# Altium project local.PrjPcb
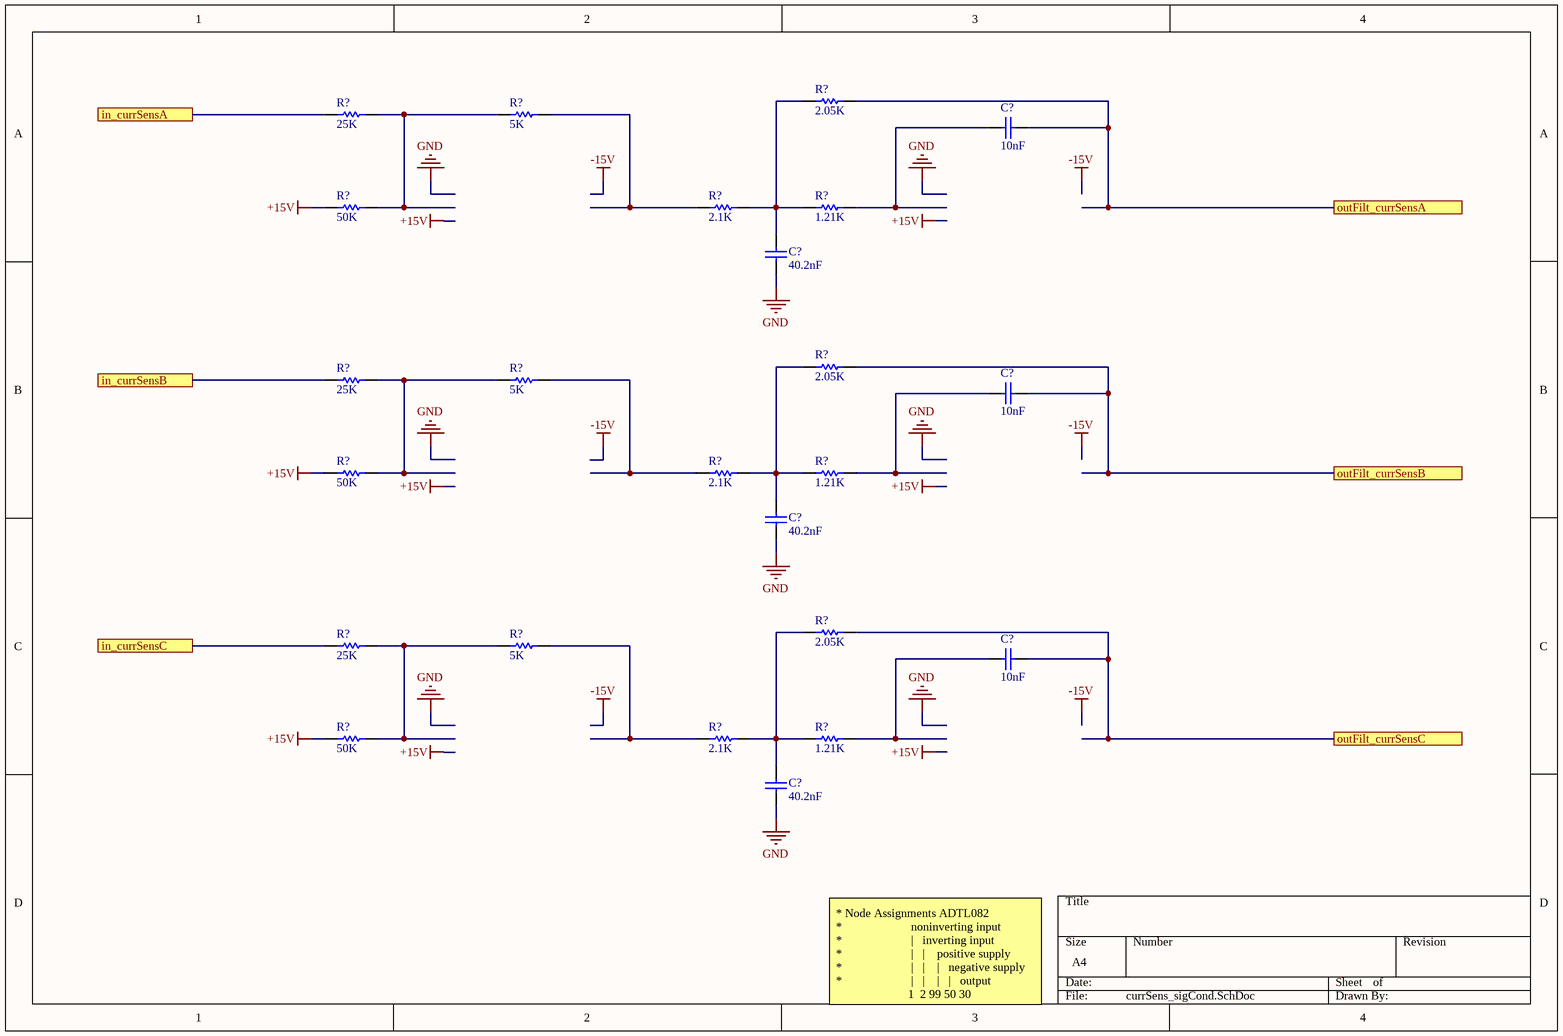
[diagram p0: currSens_sigCond.SchDoc]
4 sheets, 63 parts. Net scope: hierarchical (ports join the sheet entries above them; power ports are global).
Sheets:
  currSens_sigCond.SchDoc
  voltSens_sigCond.SchDoc
  connector.SchDoc
    Designator = buffer.SchDoc

## Sheet currSens_sigCond.SchDoc
size A4; SheetNumber: 1; SheetTotal: 4; SPICEModelCacheTGBYDHUA: <root> / <DocumentId>TGBYDHUA</DocumentId> / </root>

### Parts
(Parts that share a designator on the sheet are numbered #1, #2 ... from top to bottom, then left to right.)
C?#1  value 10nF  (hidden comment: Capacitor)
C?#2  value 40.2nF  (hidden comment: Capacitor)
C?#3  value 10nF  (hidden comment: Capacitor)
C?#4  value 40.2nF  (hidden comment: Capacitor)
C?#5  value 10nF  (hidden comment: Capacitor)
C?#6  value 40.2nF  (hidden comment: Capacitor)
R?#1  value 2.05K  (hidden comment: Resistor)
R?#2  value 25K  (hidden comment: Resistor)
R?#3  value 5K  (hidden comment: Resistor)
R?#4  value 50K  (hidden comment: Resistor)
R?#5  value 2.1K  (hidden comment: Resistor)
R?#6  value 1.21K  (hidden comment: Resistor)
R?#7  value 2.05K  (hidden comment: Resistor)
R?#8  value 25K  (hidden comment: Resistor)
R?#9  value 5K  (hidden comment: Resistor)
R?#10  value 50K  (hidden comment: Resistor)
R?#11  value 2.1K  (hidden comment: Resistor)
R?#12  value 1.21K  (hidden comment: Resistor)
R?#13  value 2.05K  (hidden comment: Resistor)
R?#14  value 25K  (hidden comment: Resistor)
R?#15  value 5K  (hidden comment: Resistor)
R?#16  value 50K  (hidden comment: Resistor)
R?#17  value 2.1K  (hidden comment: Resistor)
R?#18  value 1.21K  (hidden comment: Resistor)

### Ports
in_currSensA, in_currSensB, in_currSensC, outFilt_currSensA, outFilt_currSensB, outFilt_currSensC

### Nets
+15V: R?#4.1 R?#10.1 R?#16.1
GND: C?#2.1 C?#4.1 C?#6.1
NetC?#1_1: C?#1.1 R?#6.2
NetC?#1_2: C?#1.2 R?#1.2 ; port outFilt_currSensA
NetC?#2_2: C?#2.2 R?#1.1 R?#5.2 R?#6.1
NetC?#3_1: C?#3.1 R?#12.2
NetC?#3_2: C?#3.2 R?#7.2 ; port outFilt_currSensB
NetC?#4_2: C?#4.2 R?#7.1 R?#11.2 R?#12.1
NetC?#5_1: C?#5.1 R?#18.2
NetC?#5_2: C?#5.2 R?#13.2 ; port outFilt_currSensC
NetC?#6_2: C?#6.2 R?#13.1 R?#17.2 R?#18.1
NetR?#2_1: R?#2.1 ; port in_currSensA
NetR?#2_2: R?#2.2 R?#3.1 R?#4.2
NetR?#3_2: R?#3.2 R?#5.1
NetR?#8_1: R?#8.1 ; port in_currSensB
NetR?#8_2: R?#8.2 R?#9.1 R?#10.2
NetR?#9_2: R?#9.2 R?#11.1
NetR?#14_1: R?#14.1 ; port in_currSensC
NetR?#14_2: R?#14.2 R?#15.1 R?#16.2
NetR?#15_2: R?#15.2 R?#17.1

### Notes on the sheet
- * Node Assignments ADTL082
  *                       noninverting input
  *                       |   inverting input
  *                       |   |    positive supply
  *                       |   |    |   negative supply
  *                       |   |    |   |   output
  1  2 99 50 30

### Library data of the parts
C?#1-C?#6 = Capacitor: SimulationGenericComponent: True
R?#1-R?#18 = Resistor: TC1: 0; SimulationGenericComponent: True; TC2: 0

## Sheet voltSens_sigCond.SchDoc
size A4; SheetNumber: 2; SheetTotal: 4; SPICEModelCacheTGBYDHUA: <root> / <DocumentId>TGBYDHUA</DocumentId> / </root>
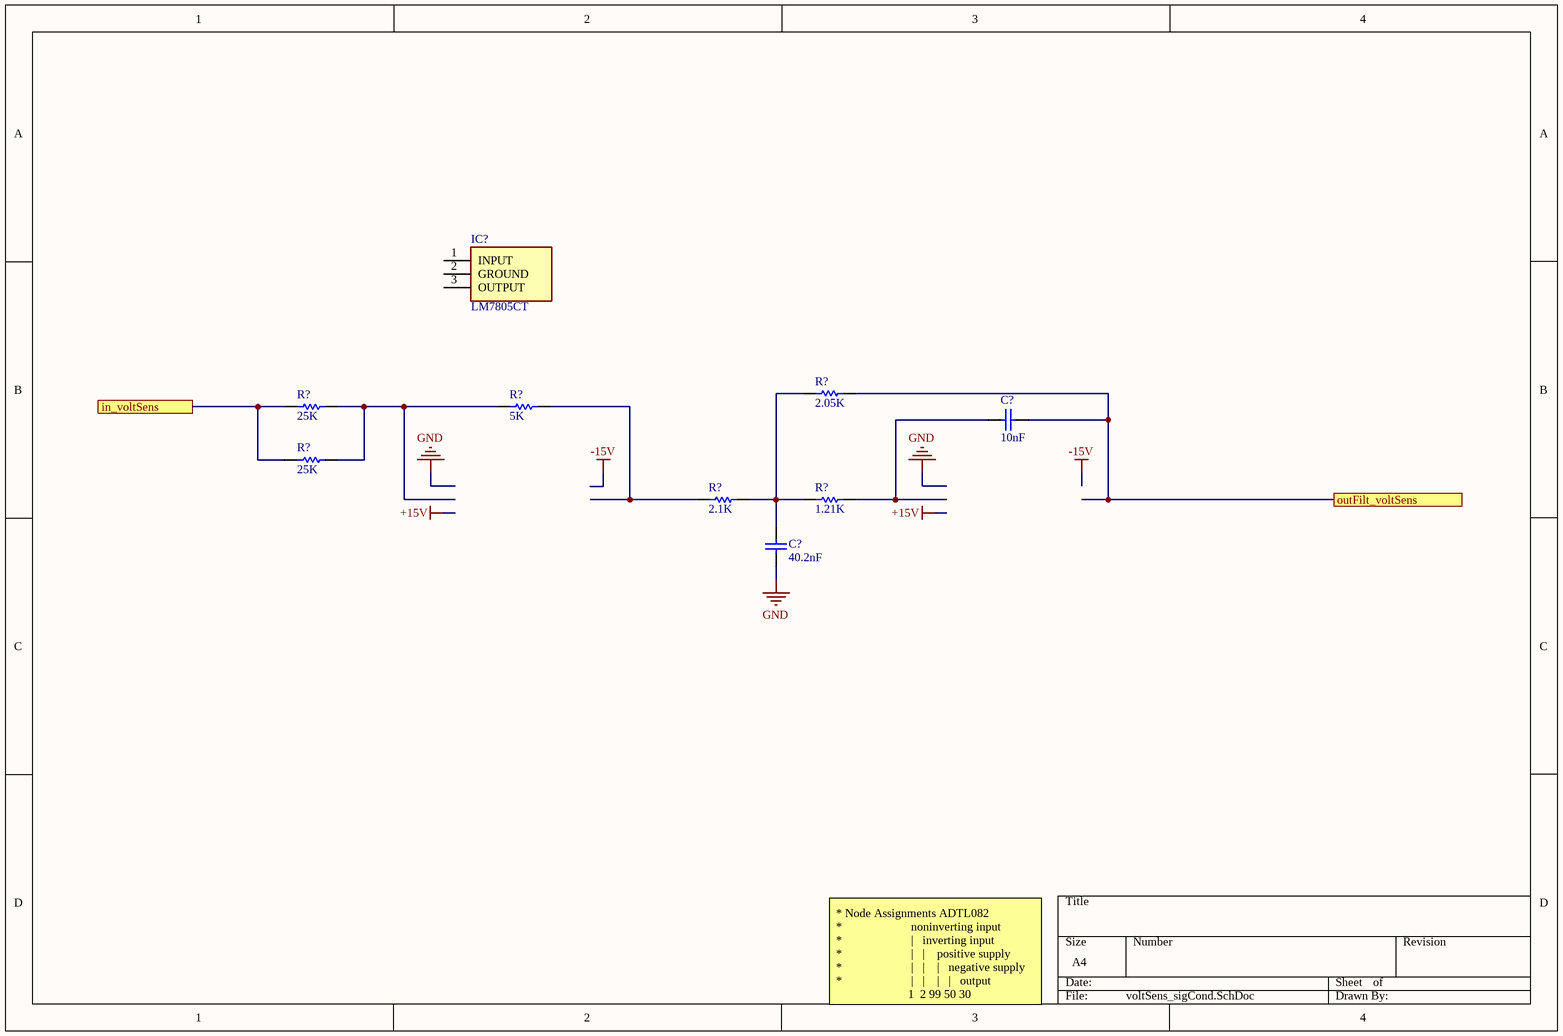
[diagram p1: voltSens_sigCond.SchDoc]

### Parts
(Parts that share a designator on the sheet are numbered #1, #2 ... from top to bottom, then left to right.)
C?#7  value 10nF  (hidden comment: Capacitor)
C?#8  value 40.2nF  (hidden comment: Capacitor)
IC?#1  LM7805CT  [TO254P470X1028X1955-3P]
R?#19  value 2.05K  (hidden comment: Resistor)
R?#20  value 25K  (hidden comment: Resistor)
R?#21  value 5K  (hidden comment: Resistor)
R?#22  value 25K  (hidden comment: Resistor)
R?#23  value 2.1K  (hidden comment: Resistor)
R?#24  value 1.21K  (hidden comment: Resistor)

### Ports
in_voltSens, outFilt_voltSens

### Nets
GND: C?#8.1
NetC?#7_1: C?#7.1 R?#24.2
NetC?#7_2: C?#7.2 R?#19.2 ; port outFilt_voltSens
NetC?#8_2: C?#8.2 R?#19.1 R?#23.2 R?#24.1
NetR?#20_1: R?#20.1 R?#22.1 ; port in_voltSens
NetR?#20_2: R?#20.2 R?#21.1 R?#22.2
NetR?#21_2: R?#21.2 R?#23.1

Not connected (* = marked no-connect by the designer): IC?#1 1(INPUT) 2(GROUND) 3(OUTPUT)

### Notes on the sheet
- * Node Assignments ADTL082
  *                       noninverting input
  *                       |   inverting input
  *                       |   |    positive supply
  *                       |   |    |   negative supply
  *                       |   |    |   |   output
  1  2 99 50 30

### Library data of the parts
C?#7 C?#8 = Capacitor: SimulationGenericComponent: True
IC?#1 = LM7805CT: Integrated Circuit; Manufacturer_Name: Texas Instruments; Datasheet Link: http://www.ti.com/lit/ds/symlink/lm340.pdf; Height: 4.7mm; Manufacturer_Part_Number: LM7805CT; Mouser Part Number: 926-LM7805CT; Mouser Price/Stock: https://www.mouser.co.uk/ProductDetail/Texas-Instruments/LM7805CT?qs=QbsRYf82W3EaqXeMDVwIfQ%3D%3D; Arrow Part Number: LM7805CT; Arrow Price/Stock: https://www.arrow.com/en/products/lm7805ct/texas-instruments?region=europe
R?#19-R?#24 = Resistor: TC1: 0; SimulationGenericComponent: True; TC2: 0

## Sheet connector.SchDoc
size A4; SheetNumber: 3; SheetTotal: 4
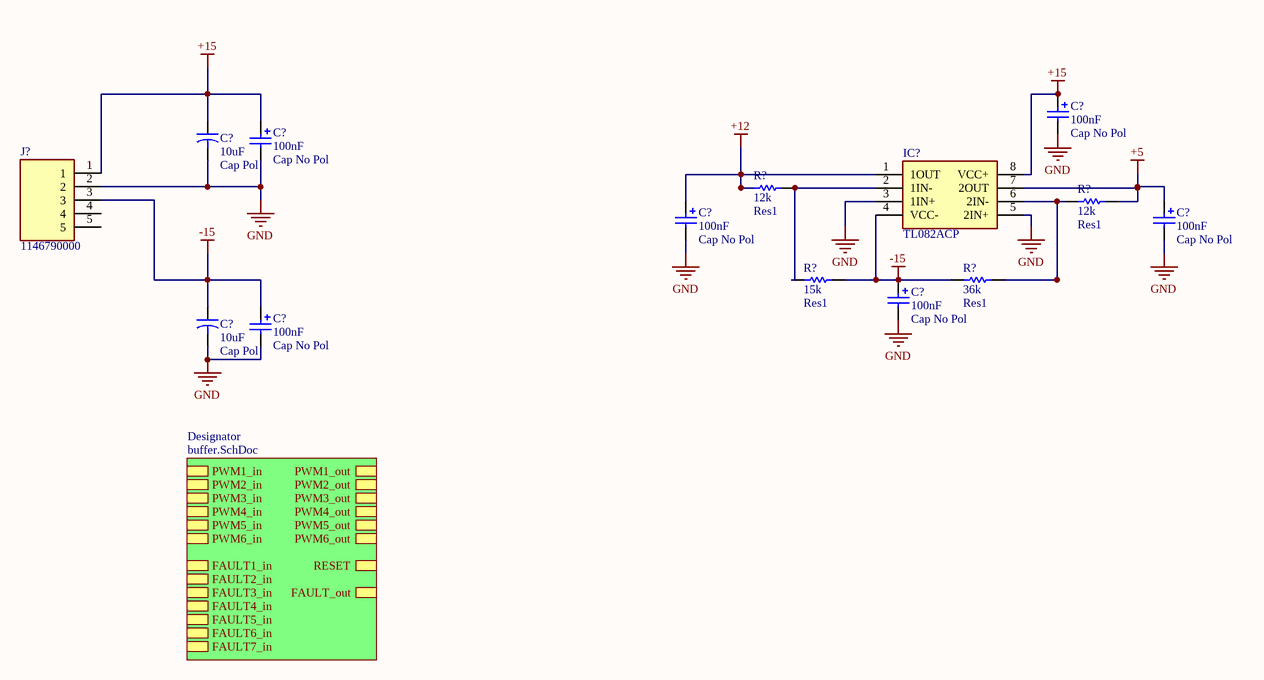
[diagram p2: connector.SchDoc]

### Parts
(Parts that share a designator on the sheet are numbered #1, #2 ... from top to bottom, then left to right.)
C?#9  Cap No Pol  value 100nF  [RAD-0.1]
C?#10  Cap Pol  value 10uF  [CAPR5-4X5]
C?#11  Cap No Pol  value 100nF  [RAD-0.1]
C?#12  Cap No Pol  value 100nF  [RAD-0.1]
C?#13  Cap No Pol  value 100nF  [RAD-0.1]
C?#14  Cap No Pol  value 100nF  [RAD-0.1]
C?#15  Cap Pol  value 10uF  [CAPR5-4X5]
C?#16  Cap No Pol  value 100nF  [RAD-0.1]
IC?#2  TL082ACP  [DIP794W53P254L959H508Q8N]
J?  1146790000  [1146790000]
R?#25  Res1  value 12k  [AXIAL-0.3]
R?#26  Res1  value 12k  [AXIAL-0.3]
R?#27  Res1  value 15k  [AXIAL-0.3]
R?#28  Res1  value 36k  [AXIAL-0.3]

### Sub-sheets
Designator = buffer.SchDoc: PWM1_in, PWM2_in, PWM3_in, PWM4_in, PWM5_in, PWM6_in, FAULT1_in, FAULT2_in, FAULT3_in, FAULT4_in, FAULT5_in, FAULT6_in, FAULT7_in, PWM1_out, PWM2_out, PWM3_out, PWM4_out, PWM5_out, PWM6_out, RESET, FAULT_out

### Nets
+5: C?#13.1 IC?#2.7(2OUT) R?#26.2
+12: C?#12.1 IC?#2.1(1OUT) R?#25.1
+15: C?#9.1 C?#10.1 C?#11.1 IC?#2.8(VCC+) J?.1
-15: C?#14.1 C?#15.1 C?#16.1 IC?#2.4(VCC-) J?.3 R?#27.2 R?#28.1
GND: C?#9.2 C?#10.2 C?#11.2 C?#12.2 C?#13.2 C?#14.2 C?#15.2 C?#16.2 IC?#2.3(1IN+) IC?#2.5(2IN+) J?.2
NetIC?#2_2: IC?#2.2(1IN-) R?#25.2 R?#27.1
NetIC?#2_6: IC?#2.6(2IN-) R?#26.1 R?#28.2

Not connected (* = marked no-connect by the designer): J? 4 5

### Library data of the parts
C?#9 C?#11-C?#14 C?#16 = Cap No Pol: Polarized Capacitor (Radial); Published: 8-Jun-2000; LatestRevisionDate: 17-Jul-2002; LatestRevisionNote: Re-released for DXP Platform.; PackageReference: RB7.6-15; Publisher: Altium Limited; PackageDescription: Polarized Capacitor (Radial); 2 Leads
C?#10 C?#15 = Cap Pol: Capacitor; Published: 23-Sep-2002; PackageReference: CAPR5-4X5; Publisher: Altium Limited; PackageDescription: Capacitor; 2 Leads
IC?#2 = TL082ACP: Integrated Circuit; Manufacturer_Name: Texas Instruments; Datasheet Link: http://www.ti.com/lit/ds/symlink/tl081a.pdf; Height: 5.08mm; Manufacturer_Part_Number: TL082ACP; Mouser Part Number: 595-TL082ACP; Mouser Price/Stock: https://www.mouser.co.uk/ProductDetail/Texas-Instruments/TL082ACP?qs=0le1rQK8zxrLXibbSNmvcA%3D%3D; Arrow Part Number: TL082ACP; Arrow Price/Stock: https://www.arrow.com/en/products/tl082acp/texas-instruments?utm_currency=USD&region=nac
J? = 1146790000: Connector; Manufacturer_Name: Weidmuller; Datasheet Link: http://catalog.weidmueller.com/createDatasheetForMobile.do?ordernumber=1146790000&scope1=1&scope2=1&localeId=en; Height: 8.4mm; Manufacturer_Part_Number: 1146790000
R?#25-R?#28 = Res1: Resistor; Published: 8-Jun-2000; LatestRevisionDate: 17-Jul-2002; LatestRevisionNote: Re-released for DXP Platform.; PackageReference: AXIAL-0.3; Publisher: Altium Limited; PackageDescription: Axial Device, Thru-Hole; 2 Leads; 0.3 in Pin Spacing

## Sheet buffer.SchDoc
size A4; SheetNumber: 8; SheetTotal: 12
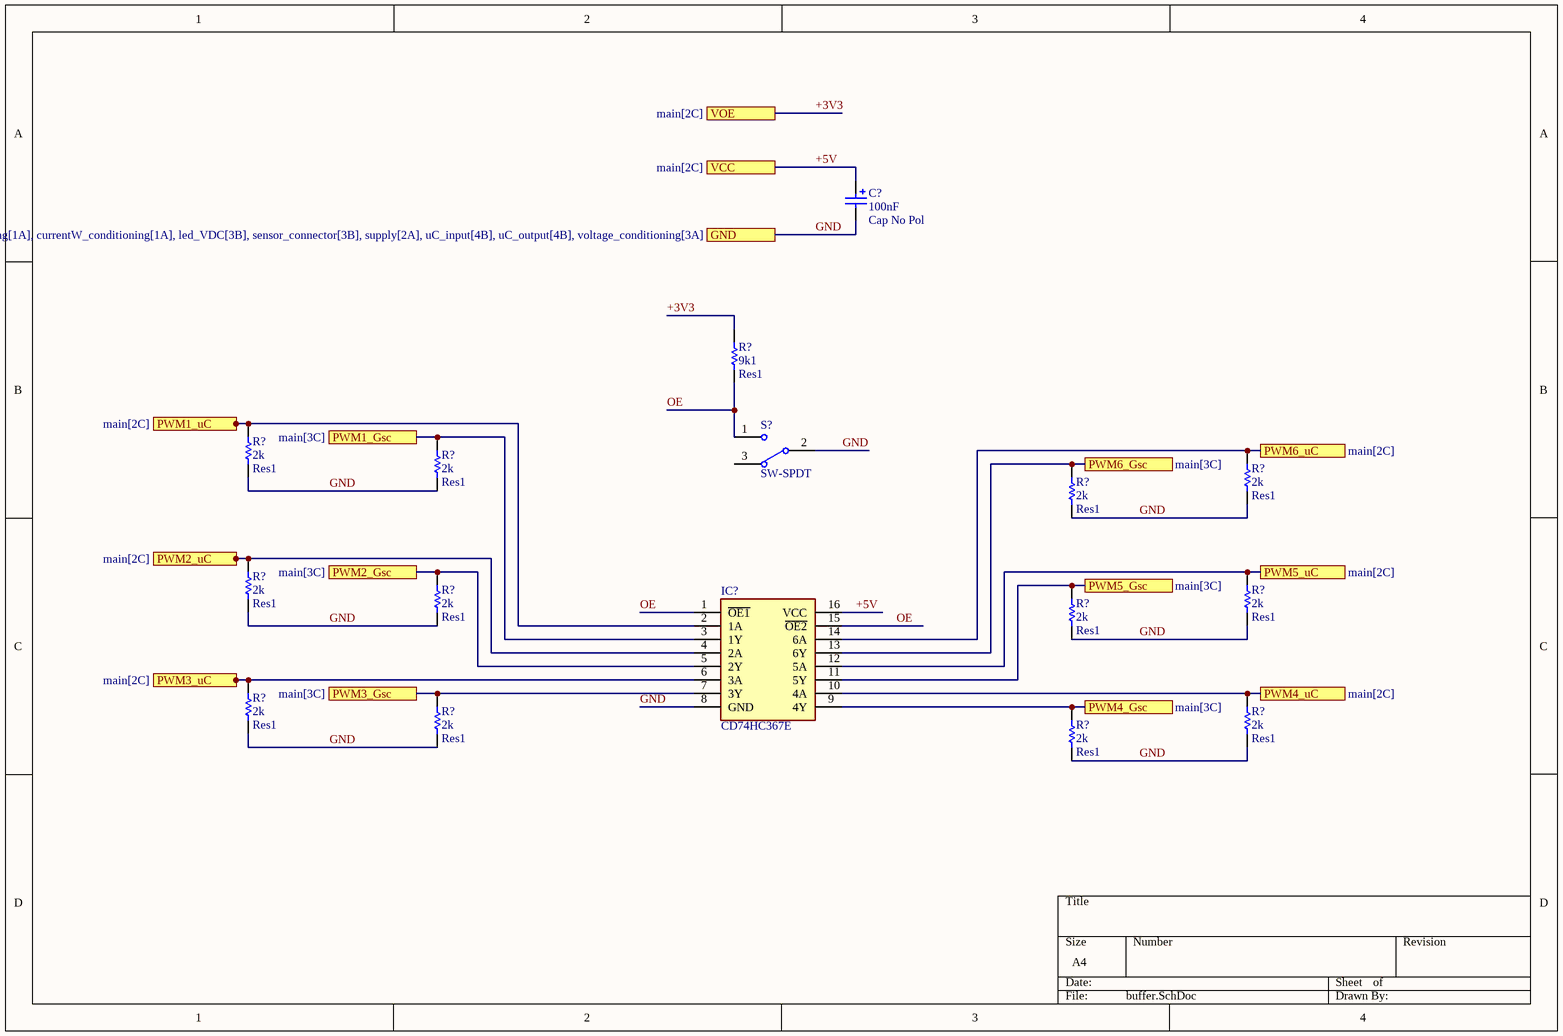
[diagram p3: buffer.SchDoc]

### Parts
(Parts that share a designator on the sheet are numbered #1, #2 ... from top to bottom, then left to right.)
C?#17  Cap No Pol  value 100nF  [RAD-0.1]
IC?#3  CD74HC367E  [DIP794W53P254L1930H508Q16N]
R?#29  Res1  value 9k1  [AXIAL-0.3]
R?#30  Res1  value 2k  [AXIAL-0.3]
R?#31  Res1  value 2k  [AXIAL-0.3]
R?#32  Res1  value 2k  [AXIAL-0.3]
R?#33  Res1  value 2k  [AXIAL-0.3]
R?#34  Res1  value 2k  [AXIAL-0.3]
R?#35  Res1  value 2k  [AXIAL-0.3]
R?#36  Res1  value 2k  [AXIAL-0.3]
R?#37  Res1  value 2k  [AXIAL-0.3]
R?#38  Res1  value 2k  [AXIAL-0.3]
R?#39  Res1  value 2k  [AXIAL-0.3]
R?#40  Res1  value 2k  [AXIAL-0.3]
R?#41  Res1  value 2k  [AXIAL-0.3]
S?  SW-SPDT  [MHDR1X3]

### Ports
GND (see main[3C], control_connector[2D], currentU_conditioning[1A], currentV_conditioning[1A], currentW_conditioning[1A], led_VDC[3B], sensor_connector[3B], supply[2A], uC_input[4B], uC_output[4B], voltage_conditioning[3A]), PWM1_Gsc (see main[3C]), PWM1_uC (see main[2C]), PWM2_Gsc (see main[3C]), PWM2_uC (see main[2C]), PWM3_Gsc (see main[3C]), PWM3_uC (see main[2C]), PWM4_Gsc (see main[3C]), PWM4_uC (see main[2C]), PWM5_Gsc (see main[3C]), PWM5_uC (see main[2C]), PWM6_Gsc (see main[3C]), PWM6_uC (see main[2C]), VCC (see main[2C]), VOE (see main[2C])

### Nets
+3V3: R?#29.2 ; port VOE
+5V: C?#17.1 IC?#3.16(VCC) ; port VCC
GND: C?#17.2 IC?#3.8(GND) R?#30.1 R?#31.1 R?#32.1 R?#33.1 R?#34.1 R?#35.1 R?#36.1 R?#37.1 R?#38.1 R?#39.1 R?#40.1 R?#41.1 S?.2 ; port GND
OE: IC?#3.1(~{OE1}) IC?#3.15(~{OE2}) R?#29.1 S?.1
NetIC?#3_2: IC?#3.2(1A) R?#30.2 ; port PWM1_uC
NetIC?#3_3: IC?#3.3(1Y) R?#31.2 ; port PWM1_Gsc
NetIC?#3_4: IC?#3.4(2A) R?#34.2 ; port PWM2_uC
NetIC?#3_5: IC?#3.5(2Y) R?#35.2 ; port PWM2_Gsc
NetIC?#3_6: IC?#3.6(3A) R?#38.2 ; port PWM3_uC
NetIC?#3_7: IC?#3.7(3Y) R?#39.2 ; port PWM3_Gsc
NetIC?#3_9: IC?#3.9(4Y) R?#41.2 ; port PWM4_Gsc
NetIC?#3_10: IC?#3.10(4A) R?#40.2 ; port PWM4_uC
NetIC?#3_11: IC?#3.11(5Y) R?#37.2 ; port PWM5_Gsc
NetIC?#3_12: IC?#3.12(5A) R?#36.2 ; port PWM5_uC
NetIC?#3_13: IC?#3.13(6Y) R?#33.2 ; port PWM6_Gsc
NetIC?#3_14: IC?#3.14(6A) R?#32.2 ; port PWM6_uC

Not connected (* = marked no-connect by the designer): S? 3

### Library data of the parts
C?#17 = Cap No Pol: Polarized Capacitor (Radial); Published: 8-Jun-2000; LatestRevisionDate: 17-Jul-2002; LatestRevisionNote: Re-released for DXP Platform.; PackageReference: RB7.6-15; Publisher: Altium Limited; PackageDescription: Polarized Capacitor (Radial); 2 Leads
IC?#3 = CD74HC367E: Integrated Circuit; Manufacturer_Name: Texas Instruments; Datasheet Link: https://www.ti.com/lit/ds/symlink/cd74hc367.pdf?ts=1619589374451&ref_url=https%253A%252F%252Fwww.ti.com%252Fstore%252Fti%252Fen%252Fp%252Fproduct%252F%253Fp%253DCD74HC367E; Height: 5.08mm; Manufacturer_Part_Number: CD74HC367E; Mouser Part Number: 595-CD74HC367E; Mouser Price/Stock: https://www.mouser.co.uk/ProductDetail/Texas-Instruments/CD74HC367E?qs=xFfolx0DHx1dmtXXzN7naA%3D%3D
R?#29-R?#41 = Res1: Resistor; Published: 8-Jun-2000; LatestRevisionDate: 17-Jul-2002; LatestRevisionNote: Re-released for DXP Platform.; PackageReference: AXIAL-0.3; Publisher: Altium Limited; PackageDescription: Axial Device, Thru-Hole; 2 Leads; 0.3 in Pin Spacing
S? = SW-SPDT: SPDT Subminiature Toggle Switch, Right Angle Mounting, Vertical Actuation; Published: 24-Mar-1999; LatestRevisionDate: 17-Dec-2003; LatestRevisionNote: Schematic revised, PCB Footprint replaced.; DatasheetVersion: 05-Dec-2000; PackageReference: TL36WW15050; Publisher: Altium Limited; PackageDescription: Switch; 4 Leads; ComponentLink1Description: Manufacturer Link; ComponentLink1URL: http://www.apem.com

## Nets that join several sheets
GND: currSens_sigCond (C?#2.1 C?#4.1 C?#6.1), voltSens_sigCond (C?#8.1), connector (11 pins)